# Altium schematic sheet PowerModule.SchDoc
size A3; SheetNumber: 1; SheetTotal: 4
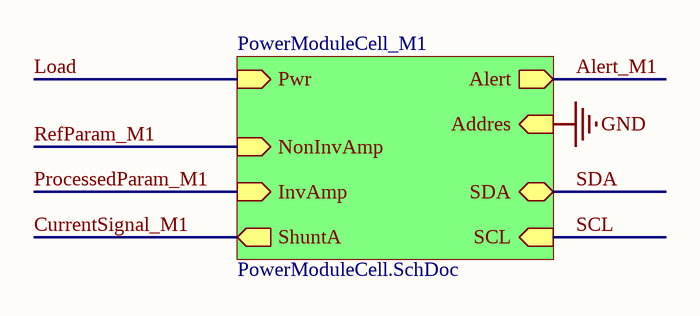
[diagram p0: PowerModule.SchDoc]

## Sub-sheets
PowerModuleCell_M1 = PowerModuleCell.SchDoc: Alert (out), Addres (in), SDA (bidir), SCL (in), Pwr (in), NonInvAmp (in), InvAmp (in), ShuntA (out)

## Nets
GND: sheet PowerModuleCell_M1/Addres
Alert_M1: sheet PowerModuleCell_M1/Alert
CurrentSignal_M1: sheet PowerModuleCell_M1/ShuntA
Load: sheet PowerModuleCell_M1/Pwr
ProcessedParam_M1: sheet PowerModuleCell_M1/InvAmp
RefParam_M1: sheet PowerModuleCell_M1/NonInvAmp
SCL: sheet PowerModuleCell_M1/SCL
SDA: sheet PowerModuleCell_M1/SDA